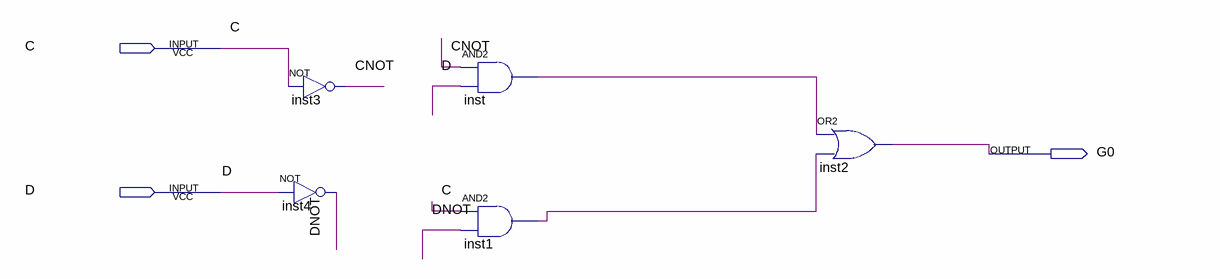
[diagram p0: schematic sheet]
// Quartus schematic Lab03G0.bdf as structural Verilog: 5 symbols, 3 pins
module Lab03G0 (
  input  C,
  input  D,
  output G0
);

  wire CNOT, DNOT, inst1_out, inst_out;

  not inst3 (CNOT, C);
  not inst4 (DNOT, D);
  and inst (inst_out, CNOT, D);
  and inst1 (inst1_out, C, DNOT);
  or inst2 (G0, inst_out, inst1_out);
endmodule
